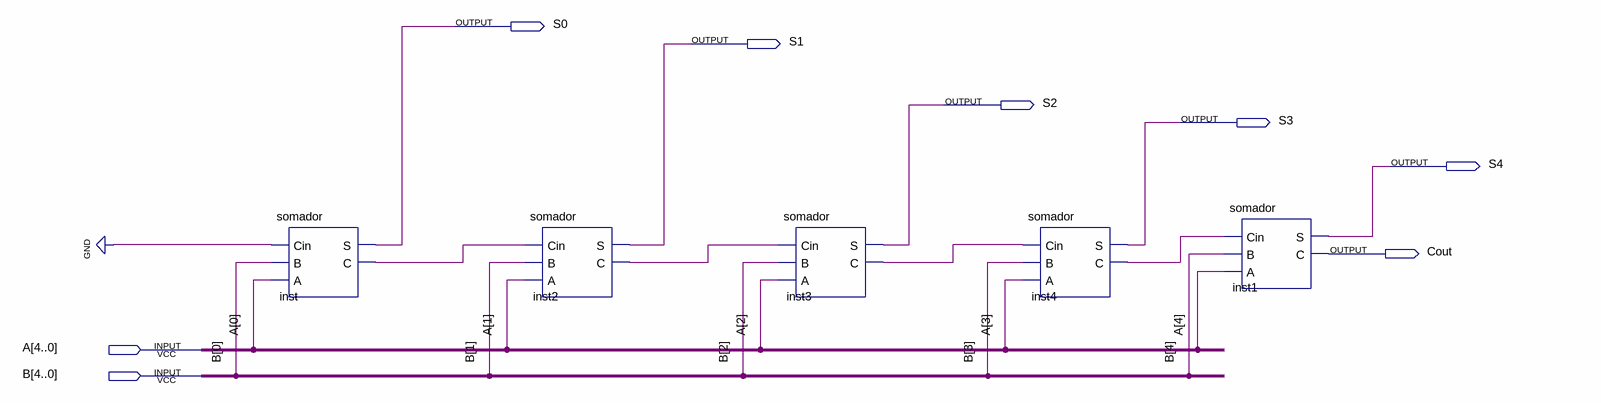
[diagram p0: schematic sheet]
// Quartus schematic somador5bits.bdf as structural Verilog: 5 symbols, 8 pins
module somador5bits (
  input  [4:0] A,
  input  [4:0] B,
  output S0,
  output S1,
  output S2,
  output S3,
  output S4,
  output Cout
);

  wire inst2_c, inst3_c, inst4_c, inst_c;

  somador inst (.Cin(1'b0), .B(B[0]), .A(A[0]), .S(S0), .C(inst_c));
  somador inst2 (.Cin(inst_c), .B(B[1]), .A(A[1]), .S(S1), .C(inst2_c));
  somador inst3 (.Cin(inst2_c), .B(B[2]), .A(A[2]), .S(S2), .C(inst3_c));
  somador inst4 (.Cin(inst3_c), .B(B[3]), .A(A[3]), .S(S3), .C(inst4_c));
  somador inst1 (.Cin(inst4_c), .B(B[4]), .A(A[4]), .S(S4), .C(Cout));
endmodule
